# Altium schematic sheet The Fun Buttons' Friends.SchDoc
size A4
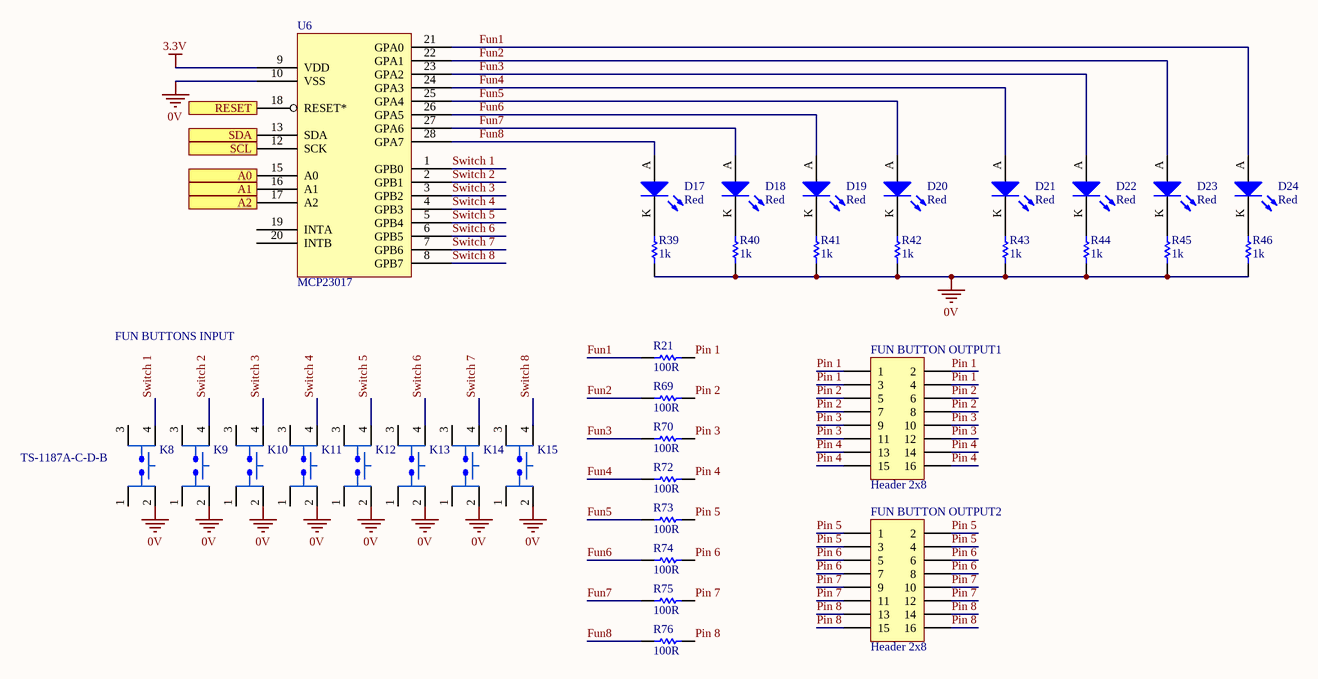
[diagram p0: The Fun Buttons' Friends.SchDoc]

## Parts
D17  Red  [0805 LED]
D18  Red  [0805 LED]
D19  Red  [0805 LED]
D20  Red  [0805 LED]
D21  Red  [0805 LED]
D22  Red  [0805 LED]
D23  Red  [0805 LED]
D24  Red  [0805 LED]
FUN_BUTTON_OUTPUT1  Header 2x8  [Header 2x8]
FUN_BUTTON_OUTPUT2  Header 2x8  [Header 2x8]
K8  TS-1187A-C-D-B  [XKB SW-4.5]
K9  TS-1187A-C-D-B  [XKB SW-4.5]  (value not drawn)
K10  TS-1187A-C-D-B  [XKB SW-4.5]  (value not drawn)
K11  TS-1187A-C-D-B  [XKB SW-4.5]  (value not drawn)
K12  TS-1187A-C-D-B  [XKB SW-4.5]  (value not drawn)
K13  TS-1187A-C-D-B  [XKB SW-4.5]  (value not drawn)
K14  TS-1187A-C-D-B  [XKB SW-4.5]  (value not drawn)
K15  TS-1187A-C-D-B  [XKB SW-4.5]  (value not drawn)
R21  100R  [0805]
R39  1k  [0805]
R40  1k  [0805]
R41  1k  [0805]
R42  1k  [0805]
R43  1k  [0805]
R44  1k  [0805]
R45  1k  [0805]
R46  1k  [0805]
R69  100R  [0805]
R70  100R  [0805]
R72  100R  [0805]
R73  100R  [0805]
R74  100R  [0805]
R75  100R  [0805]
R76  100R  [0805]
U6  MCP23017  [Microchip 28-SOIC]

## Ports
A0, A1, A2, RESET, SCL, SDA

## Nets
0V: K8.2(VDD) K9.2(VDD) K10.2(VDD) K11.2(VDD) K12.2(VDD) K13.2(VDD) K14.2(VDD) K15.2(VDD) R39.1 R40.1 R41.1 R42.1 R43.1 R44.1 R45.1 R46.1 U6.10(VSS)
3.3V: U6.9(VDD)
A0: U6.15(A0) ; port A0
A1: U6.16(A1) ; port A1
A2: U6.17(A2) ; port A2
Fun1: D24.A R21.1 U6.21(GPA0)
Fun2: D23.A R69.1 U6.22(GPA1)
Fun3: D22.A R70.1 U6.23(GPA2)
Fun4: D21.A R72.1 U6.24(GPA3)
Fun5: D20.A R73.1 U6.25(GPA4)
Fun6: D19.A R74.1 U6.26(GPA5)
Fun7: D18.A R75.1 U6.27(GPA6)
Fun8: D17.A R76.1 U6.28(GPA7)
Pin 1: FUN_BUTTON_OUTPUT1.1 FUN_BUTTON_OUTPUT1.2 FUN_BUTTON_OUTPUT1.3 FUN_BUTTON_OUTPUT1.4 R21.2
Pin 2: FUN_BUTTON_OUTPUT1.5 FUN_BUTTON_OUTPUT1.6 FUN_BUTTON_OUTPUT1.7 FUN_BUTTON_OUTPUT1.8 R69.2
Pin 3: FUN_BUTTON_OUTPUT1.9 FUN_BUTTON_OUTPUT1.10 FUN_BUTTON_OUTPUT1.11 FUN_BUTTON_OUTPUT1.12 R70.2
Pin 4: FUN_BUTTON_OUTPUT1.13 FUN_BUTTON_OUTPUT1.14 FUN_BUTTON_OUTPUT1.15 FUN_BUTTON_OUTPUT1.16 R72.2
Pin 5: FUN_BUTTON_OUTPUT2.1 FUN_BUTTON_OUTPUT2.2 FUN_BUTTON_OUTPUT2.3 FUN_BUTTON_OUTPUT2.4 R73.2
Pin 6: FUN_BUTTON_OUTPUT2.5 FUN_BUTTON_OUTPUT2.6 FUN_BUTTON_OUTPUT2.7 FUN_BUTTON_OUTPUT2.8 R74.2
Pin 7: FUN_BUTTON_OUTPUT2.9 FUN_BUTTON_OUTPUT2.10 FUN_BUTTON_OUTPUT2.11 FUN_BUTTON_OUTPUT2.12 R75.2
Pin 8: FUN_BUTTON_OUTPUT2.13 FUN_BUTTON_OUTPUT2.14 FUN_BUTTON_OUTPUT2.15 FUN_BUTTON_OUTPUT2.16 R76.2
RESET: U6.18(RESET*) ; port RESET
SCL: U6.12(SCK) ; port SCL
SDA: U6.13(SDA) ; port SDA
Switch 1: K8.4(VDD) U6.1(GPB0)
Switch 2: K9.4(VDD) U6.2(GPB1)
Switch 3: K10.4(VDD) U6.3(GPB2)
Switch 4: K11.4(VDD) U6.4(GPB3)
Switch 5: K12.4(VDD) U6.5(GPB4)
Switch 6: K13.4(VDD) U6.6(GPB5)
Switch 7: K14.4(VDD) U6.7(GPB6)
Switch 8: K15.4(VDD) U6.8(GPB7)
NetD17_K: D17.K R39.2
NetD18_K: D18.K R40.2
NetD19_K: D19.K R41.2
NetD20_K: D20.K R42.2
NetD21_K: D21.K R43.2
NetD22_K: D22.K R44.2
NetD23_K: D23.K R45.2
NetD24_K: D24.K R46.2

Not connected (* = marked no-connect by the designer): K8 1(VDD) 3(VDD); K9 1(VDD) 3(VDD); K10 1(VDD) 3(VDD); K11 1(VDD) 3(VDD); K12 1(VDD) 3(VDD); K13 1(VDD) 3(VDD); K14 1(VDD) 3(VDD); K15 1(VDD) 3(VDD); U6 19(INTA) 20(INTB)

## Notes on the sheet
- FUN BUTTONS INPUT
- Title
- Size:
- Date:
- A4
- Number:
- Time:
- Revision:
- Sheet
- of
- File:

## Library data of the parts
D17-D24 = SML-210LTT86: Red LED Indication - Discrete 1.75V 0805 (2012 Metric); Manufacturer: ROHM Semiconductor; Part Number: SML-210LTT86; Colour: Red; Digikey Part Number: 511-1286-1-ND; Digikey Link: https://www.digikey.com/product-detail/en/rohm-semiconductor/SML-210LTT86/511-1286-1-ND/637099
FUN_BUTTON_OUTPUT1 FUN_BUTTON_OUTPUT2 = Header 2x8: Positions: 16; Pitch: 2.54mm; Angle: 0; Flange: No; Contact: NA; Part Number: Header 2x8; Row Spacing: 2.54mm
K8-K15 = TS-1187A-C-D-B: TACTILE SWITCHES SPST 5.10MM X 5.10MM 0.80MM SMD ROHS; Manufacturer: XKB Enerprise; Part Number: TS-1187A-C-D-B; Digikey Link: https://jlcpcb.com/client/index.html#/parts/componentSearch?searchTxt=usb
R21 R69 R70 R72-R76 = RC0805FR07100RL: Manufacturer: YAGEO; Tolerance: 0.01; Rated Voltage: 0.125W; Part Number: RC0805FR07100RL; Value: 100R; Material: FR-07; qty: 50
R39-R46 = RC0805FR071KL: Manufacturer: YAGEO; Tolerance: 0.01; Rated Voltage: 0.125W; Part Number: RC0805FR071KL; Value: 1k; Material: FR-07; qty: 50
U6 = MCP23017: IC I/O EXPANDER I2C 16B 28SOIC; Manufacturer: Microchip Technology; Part Number: MCP23017; Digikey Part Number: MCP23017T-E/SOTR-ND; Digikey Link: https://www.digikey.com/product-detail/en/microchip-technology/MCP23017T-E-SO/MCP23017T-E-SOTR-ND/964184